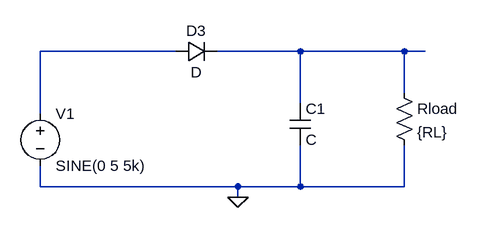
[diagram p0: schematic p7_prev1_e.asc]
p7_prev1_e.asc, the LTspice schematic file:
Version 4
SHEET 1 880 680
WIRE 192 48 -16 48
WIRE 384 48 256 48
WIRE 544 48 384 48
WIRE 576 48 544 48
WIRE 544 112 544 48
WIRE 384 128 384 48
WIRE -16 144 -16 48
WIRE -16 256 -16 224
WIRE 288 256 -16 256
WIRE 384 256 384 192
WIRE 384 256 288 256
WIRE 544 256 544 192
WIRE 544 256 384 256
WIRE 288 272 288 256
FLAG 288 272 0
SYMBOL voltage -16 128 R0
WINDOW 123 0 0 Left 0
WINDOW 39 0 0 Left 0
SYMATTR InstName V1
SYMATTR Value SINE(0 5 5k)
SYMBOL diode 192 64 R270
WINDOW 0 32 32 VTop 2
WINDOW 3 0 32 VBottom 2
SYMATTR InstName D3
SYMBOL cap 368 128 R0
SYMATTR InstName C1
SYMBOL res 528 96 R0
SYMATTR InstName Rload
SYMATTR Value {RL}

The netlist it stands for:
* p7_prev1_e.asc
V1 N001 0 SINE(0 5 5k)
D3 N001 N002 D
C1 N002 0 C
Rload N002 0 {RL}
.model D D
.lib standard.dio
.backanno
.end